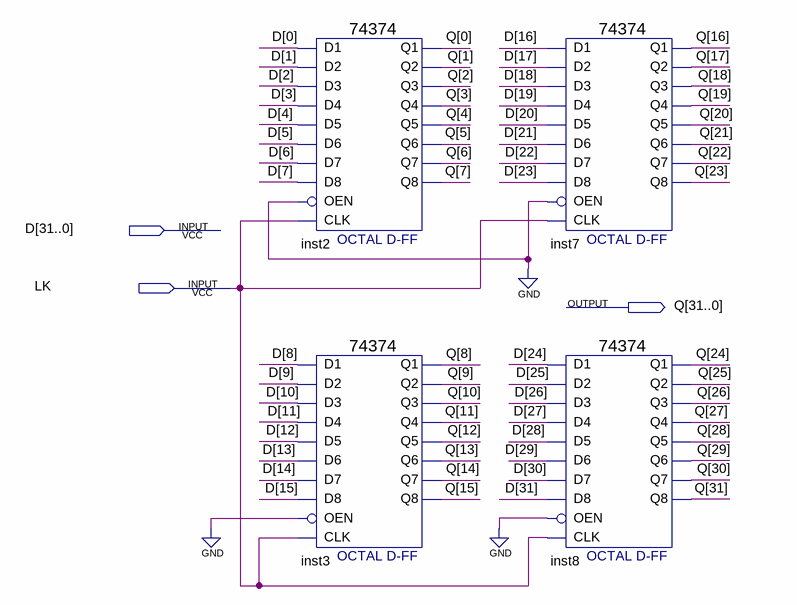
[diagram p0: schematic sheet]
// Quartus schematic LOCK32.bdf as structural Verilog: 4 symbols, 3 pins
module LOCK32 (
  input  [31:0] D,
  input  LK,
  output [31:0] Q
);

  \74374  inst2 (
    .D1(D[0]), .D2(D[1]), .D3(D[2]), .D4(D[3]), .D6(D[5]), .D5(D[4]), .OEN(1'b0), .D8(D[7]), .D7(D[6]),
    .CLK(LK), .Q2(Q[1]), .Q3(Q[2]), .Q5(Q[4]), .Q4(Q[3]), .Q6(Q[5]), .Q7(Q[6]), .Q8(Q[7]), .Q1(Q[0]));
  \74374  inst3 (
    .D1(D[8]), .D2(D[9]), .D3(D[10]), .D4(D[11]), .D6(D[13]), .D5(D[12]), .OEN(1'b0), .D8(D[15]), .D7(D[14]),
    .CLK(LK), .Q2(Q[9]), .Q3(Q[10]), .Q5(Q[12]), .Q4(Q[11]), .Q6(Q[13]), .Q7(Q[14]), .Q8(Q[15]), .Q1(Q[8]));
  \74374  inst7 (
    .D1(D[16]), .D2(D[17]), .D3(D[18]), .D4(D[19]), .D6(D[21]), .D5(D[20]), .OEN(1'b0), .D8(D[23]),
    .D7(D[22]), .CLK(LK), .Q2(Q[17]), .Q3(Q[18]), .Q5(Q[20]), .Q4(Q[19]), .Q6(Q[21]), .Q7(Q[22]), .Q8(Q[23]),
    .Q1(Q[16]));
  \74374  inst8 (
    .D1(D[24]), .D2(D[25]), .D3(D[26]), .D4(D[27]), .D6(D[29]), .D5(D[28]), .OEN(1'b0), .D8(D[31]),
    .D7(D[30]), .CLK(LK), .Q2(Q[25]), .Q3(Q[26]), .Q5(Q[28]), .Q4(Q[27]), .Q6(Q[29]), .Q7(Q[30]), .Q8(Q[31]),
    .Q1(Q[24]));
endmodule
